# Altium schematic sheet Sheet-CL_BB_01.SchDoc: BUCK / BOOST
size A3; Author: Canaan Lv; DocumentNumber: CL-BB-01; Revision: v2.1; PageSetup: Record=PageOptions|CenterHorizontal=True|CenterVertical=True|PrintScale=1.00|XCorrection=1.00|YCorrection=1.00|PrintKind=1|BorderSize=5000000|LeftOffset=0|BottomOffset=0|Orientation=2|PaperLength=1000|PaperWidth=1000|Scale=100|PaperSource=7|PrintQuality=-3|MediaType=1|DitherType=10|PrintScaleMode=1|PaperKind=A3|PaperIndex=8
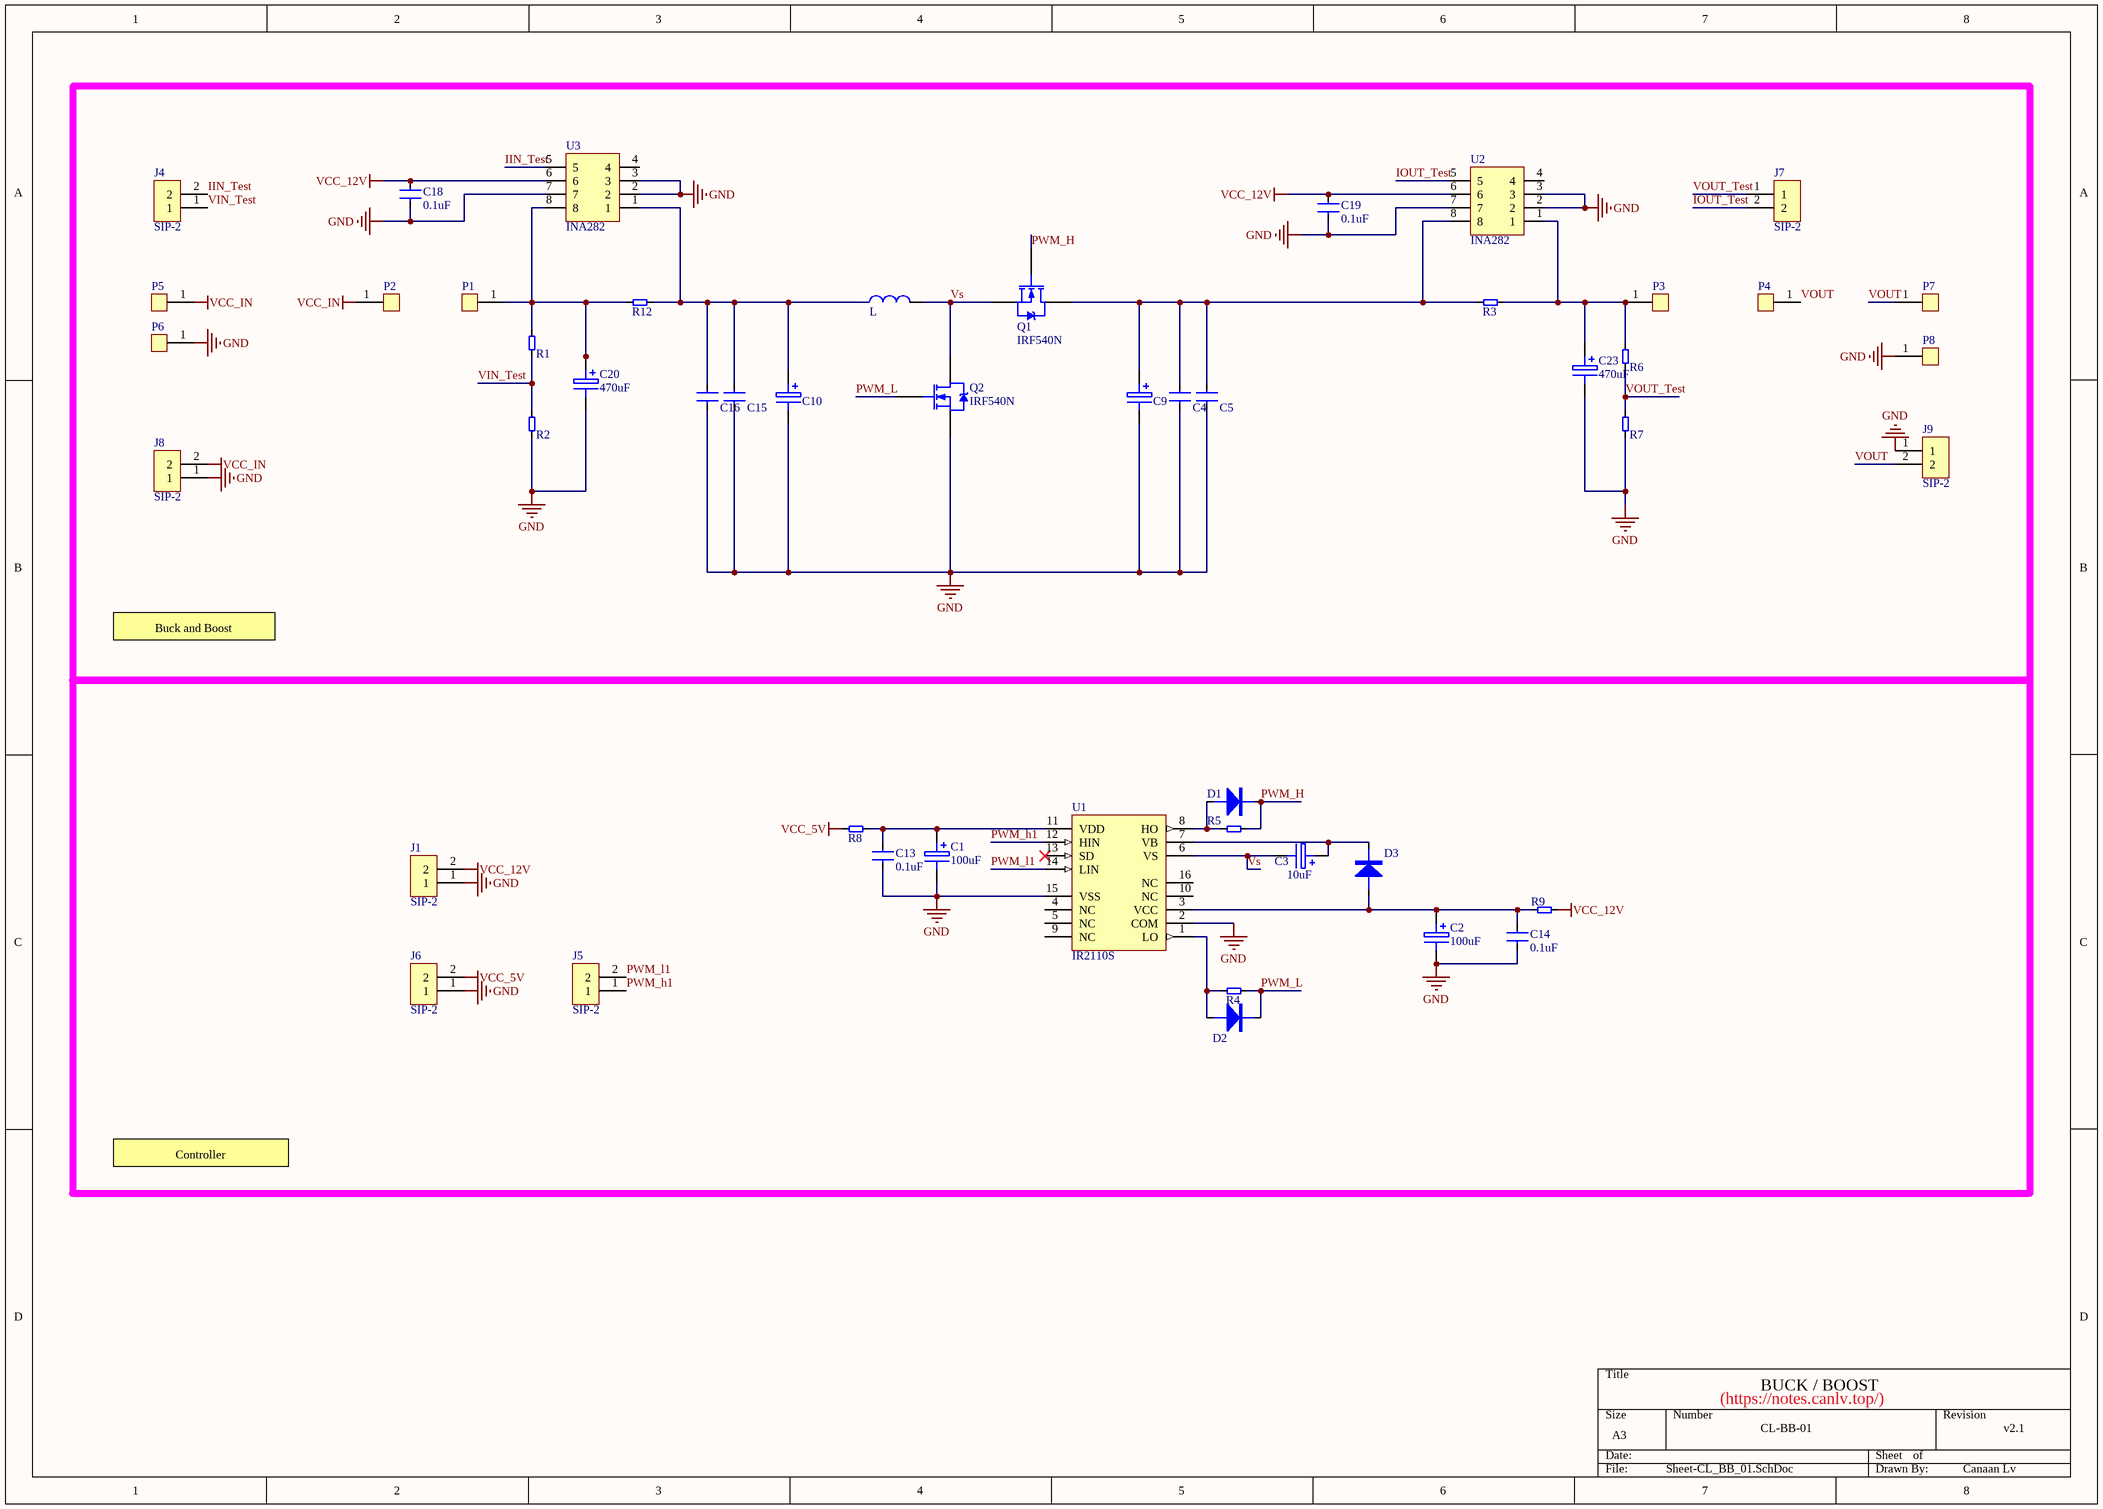
[diagram p0: Sheet-CL_BB_01.SchDoc]

## Parts
?  L  [L_15mm]
C1  100uF  [CZ0.65/25V100U]
C2  100uF  [CZ0.65/25V100U]
C3  10uF  [CZ0.50/25V4.7U]
C4  uF  [C0805]  (value not drawn)
C5  uF  [C0.254]  (value not drawn)
C9  uF  [CZ16X25]  (value not drawn)
C10  uF  [CZ16X25]  (value not drawn)
C13  0.1uF  [C1206]
C14  0.1uF  [C1206]
C15  uF  [C0.254]  (value not drawn)
C16  uF  [C0.254]  (value not drawn)
C18  0.1uF  [C0805]
C19  0.1uF  [C0805]
C20  470uF  [CZ1.00/35V470uF]
C23  470uF  [CZ1.00/35V470uF]
D1  0805D  [0805D]  (value not drawn)
D2  0805D  [0805D]  (value not drawn)
D3  DO-41  [DO-41-2]  (value not drawn)
J1  SIP-2  [2.54XH接插件2P]
J4  SIP-2  [2.54XH接插件2P]
J5  SIP-2  [2.54XH接插件2P]
J6  SIP-2  [2.54XH接插件2P]
J7  SIP-2  [2.54XH接插件2P]
J8  SIP-2  [2.54XH接插件2P]
J9  SIP-2  [2.54XH接插件2P]
P1  (no value)  [接头孔6妈妈]
P2  (no value)  [接头孔6妈妈]
P3  (no value)  [接头孔6妈妈]
P4  (no value)  [接头孔6妈妈]
P5  (no value)  [接头孔6妈妈]
P6  (no value)  [接头孔6妈妈]
P7  (no value)  [接头孔6妈妈]
P8  (no value)  [接头孔6妈妈]
Q1  IRF540N  [TO-220AB]
Q2  IRF540N  [TO-220AB]
R1  R贴片电阻  [R0805]  (value not drawn)
R2  R贴片电阻  [R0805]  (value not drawn)
R3  20m  [RES10]  (value not drawn)
R4  R贴片电阻  [R0805]  (value not drawn)
R5  R贴片电阻  [R0805]  (value not drawn)
R6  R贴片电阻  [R0805]  (value not drawn)
R7  R贴片电阻  [R0805]  (value not drawn)
R8  R贴片电阻  [R0805]  (value not drawn)
R9  R贴片电阻  [R1206]  (value not drawn)
R12  20m  [RES10]  (value not drawn)
U1  IR2110S  [SOIC16_N]
U2  INA282  [SO-8N]
U3  INA282  [SO-8N]

## Nets
GND: C1.2 C2.2 C4.2 C5.2 C9.2 C10.2 C13.2 C14.2 C15.2 C16.2 C18.2 C19.2 C20.2 C23.2 J1.1 J6.1 J8.1 J9.1 P6.1 P8.1 Q2.3(S) R2.1 R7.2 U1.2(COM) U1.15(VSS) U2.2 U2.3 U2.7 U3.2 U3.3 U3.7
VCC_5V: J6.2 R8.1
VCC_12V: C18.1 C19.1 J1.2 R9.2 U2.6 U3.6
VCC_IN: J8.2 P2.1 P5.1
IIN_Test: J4.2 U3.5
IOUT_Test: J7.2 U2.5
PWM_H: D1.K Q1.1(G) R5.1
PWM_h1: J5.1 U1.12(HIN)
PWM_L: D2.K Q2.1(G) R4.1
PWM_l1: J5.2 U1.14(LIN)
VIN_Test: J4.1 R1.1 R2.2
VOUT: J9.2 P4.1 P7.1
VOUT_Test: J7.1 R6.2 R7.1
Vs: ?.1 C3.2 Q1.3(S) Q2.2(D) U1.6(VS)
Net?_2: ?.2 C10.1 C15.1 C16.1 R12.2 U3.1
NetC1_1: C1.1 C13.1 R8.2 U1.11(VDD)
NetC2_1: C2.1 C14.1 D3.A R9.1 U1.3(VCC)
NetC3_1: C3.1 D3.K U1.7(VB)
NetC4_1: C4.1 C5.1 C9.1 Q1.2(D) R3.1 U2.8
NetC20_1: C20.1 P1.1 R1.2 R12.1 U3.8
NetC23_1: C23.1 P3.1 R3.2 R6.1 U2.1
NetD1_A: D1.A R5.2 U1.8(HO)
NetD2_A: D2.A R4.2 U1.1(LO)

Not connected (* = marked no-connect by the designer): U1 4(NC) 5(NC) 9(NC) 10(NC) 13(SD)* 16(NC); U2 4; U3 4

## Notes on the sheet
- Buck and Boost
- Controller
- (https://notes.canlv.top/)

## Library data of the parts
C1-C3 C9 C10 C20 C23 = C直插电容
C4 C13 C14 C18 C19 = C贴片电容
C5 C15 C16 = C直插无极性
P1-P8 = SIP1: Variable Resistor; Set Position: 0.5; Published: 8-Jun-2000; LatestRevisionDate: 17-Jul-2002; LatestRevisionNote: Re-released for DXP Platform.; PackageReference: AXIAL-0.6; Publisher: Altium Limited
Q1 Q2 = IRF540N: HEXFET Power MOSFET; Note: Pin 2 is electrically connected to pin 4.; Sim Note: Thermal Model provided is not called on from main Subckt.; Published: 8-Jun-2000; LatestRevisionDate: 17-Jul-2002; LatestRevisionNote: Re-released for DXP Platform.; DatasheetVersion: May-1998; PackageVersion: Feb-1997; PackageReference: TO-220AB; Publisher: Altium Limited; PackageDescription: TO, Thru-Hole, Vertical, Heatsink Mounted; 3 In-Line Leads; Pitch 2.54 mm; ComponentLink1Description: Manufacturer Link; ComponentLink1URL: http://www.irf.com/; ComponentLink2Description: Datasheet; ComponentLink2URL: http://www.irf.com/product-info/datasheets/data/irf540n.pdf
R3 R12 = R直插电阻
U1 = IR2110S: High and Low Side Driver; Note: Pins 4, 5, 9, 10 and 16 are not connected; Published: 8-Jun-2000; LatestRevisionDate: 13-Apr-2006; LatestRevisionNote: IPC-7351 Footprint Added.; DatasheetVersion: PD60147J; PackageReference: SOIC16; Publisher: Altium Limited; PackageDescription: 16-Pin Small Outline Integrated Circuit 1.27 mm Pitch; Code_JEDEC: MS-013-AA; Code_IPC: SOIC127P1030-16; ComponentLink1Description: Manufacturer Link; ComponentLink1URL: http://www.irf.com/; ComponentLink2Description: Datasheet; ComponentLink2URL: http://www.irf.com/product-info/datasheets/data/ir2110.pdf